# EAGLE design hs-64-spi (EAGLE 9.5.1)
DESIGNER: JON NEWMAN, JAKOB VOIGTS; DESIGN_NAME: HEADSTAGE-64; LICENSE: CERN OHL v1.2; REVISION: 1.2
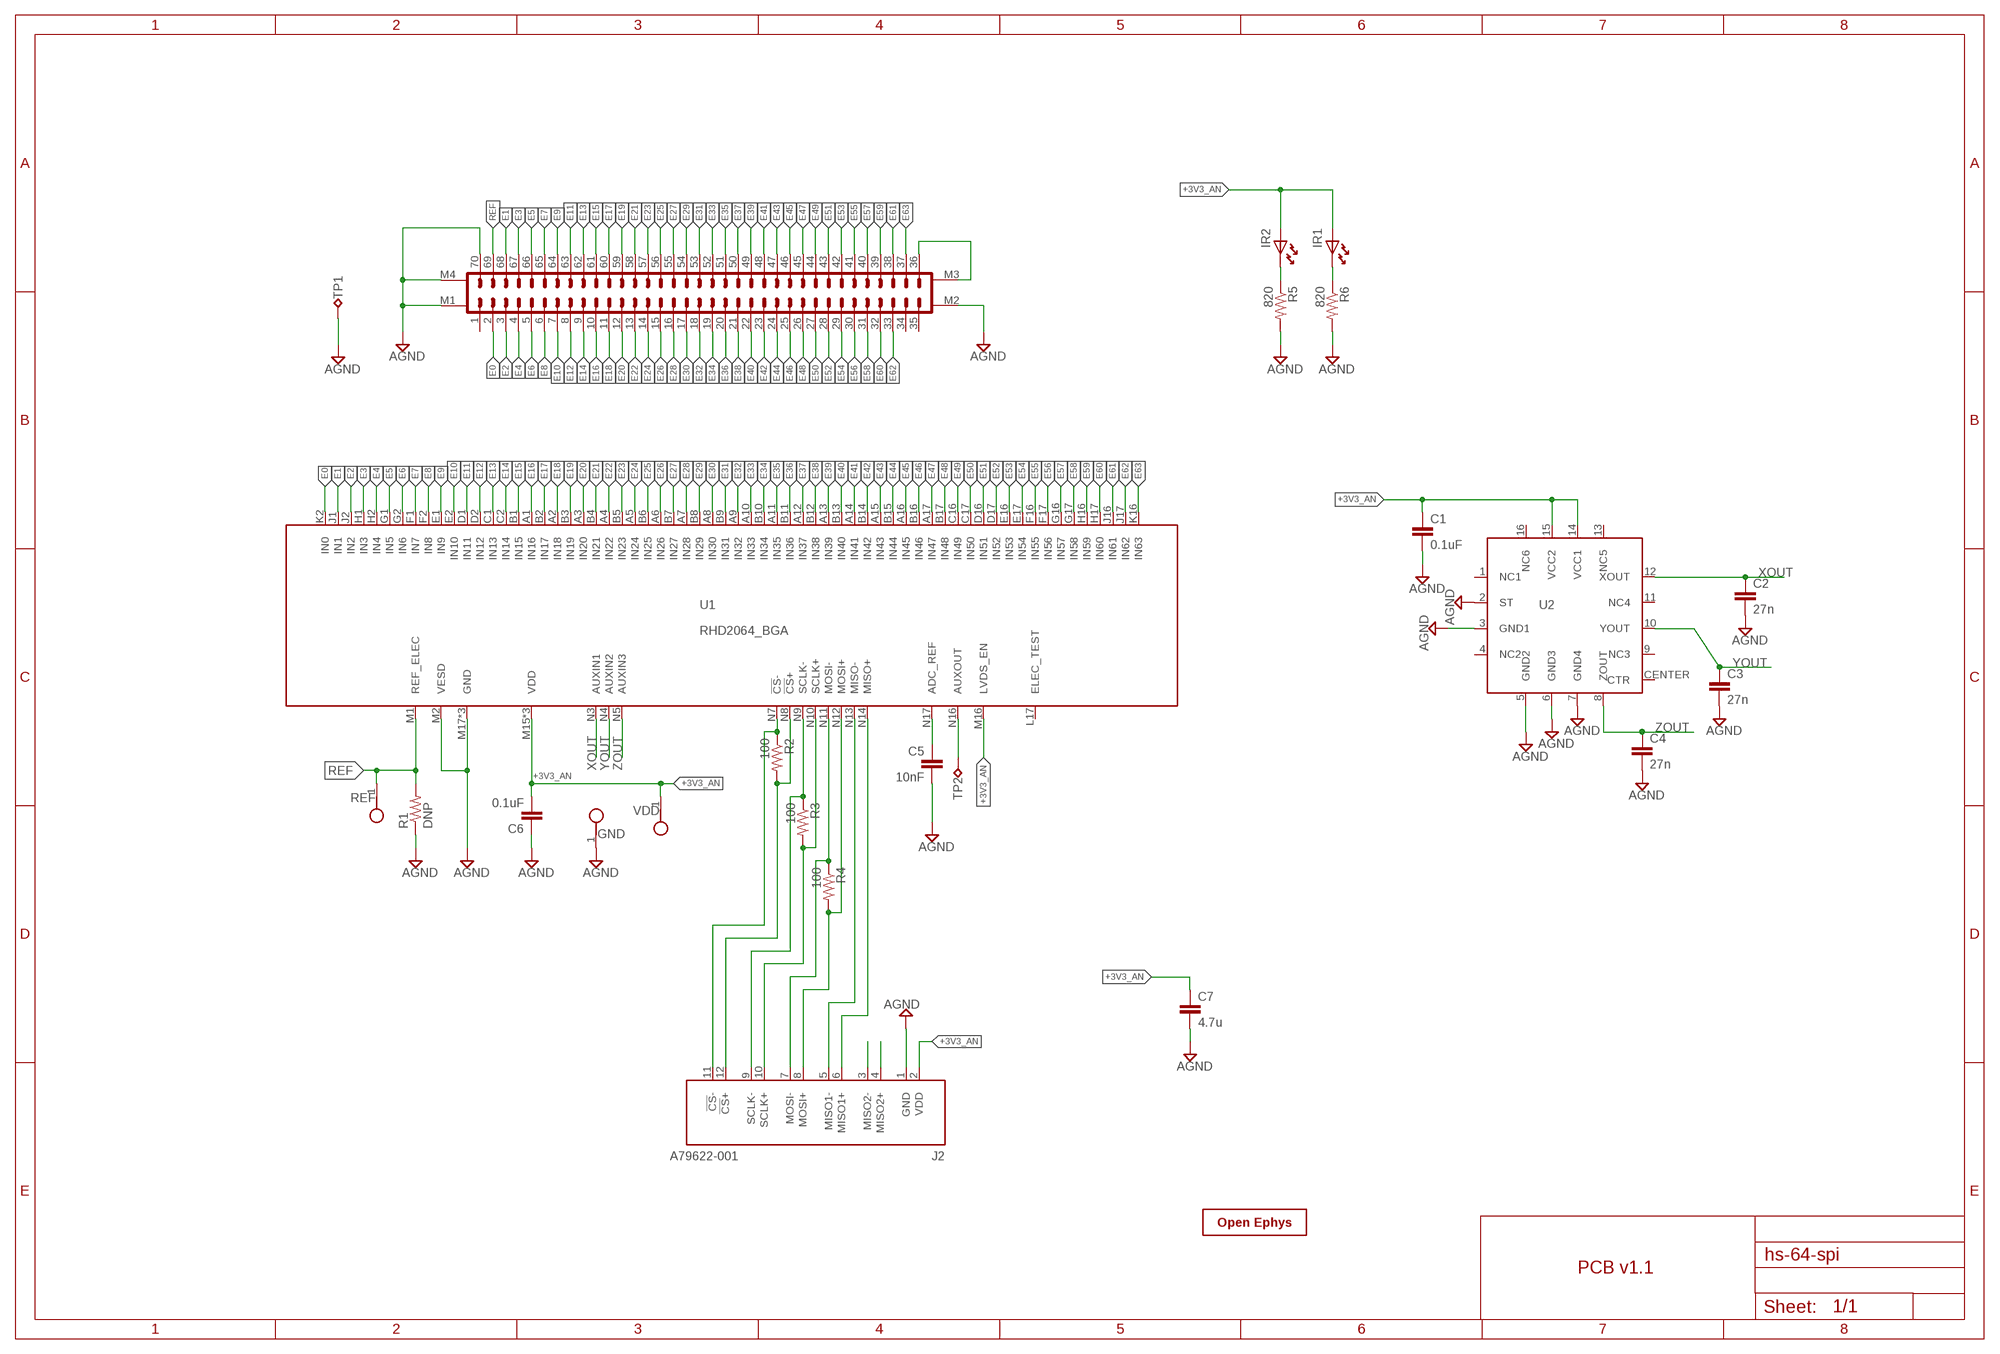
[diagram p0: schematic, sheet 1]

## Parts
C1  0.1uF  C_0402  [0402]
C2  27n  C_0402  [0402]
C3  27n  C_0402  [0402]
C4  27n  C_0402  [0402]
C5  10nF  C_0402T  [0402T]
C6  0.1uF  C_0402T  [0402T]
C7  4.7u  C_0402  [0402]
GND  TESTPOINT_SMALL  [TESTPOINT_SMALL]
IR1  LEDHAND  [LED_HAND]
IR2  LEDHAND  [LED_HAND]
J1  DF40C-70DP-0.4V(51)  PINHD-2X35+4DF40-70HEAD-LESS-SILK  [DF40-70HEAD-LESS-SILK]
J2  A79622-001  [A79622-001]
R1  DNP  R_0603  [0603]
R2  100  R_0402  [0402]
R3  100  R_0402  [0402]
R4  100  R_0402  [0402]
R5  820  R_0402  [0402]
R6  820  R_0402  [0402]
REF  TESTPOINT_SMALL  [TESTPOINT_SMALL]
TP1  VCC  TPTP07R  [TP07R]
TP2  VCC  TPTP07R  [TP07R]
U1  RHD2064_BGA  RHD2164_BGA_BGA  [BGA104_0.5MM]
U2  ADXL335_IDAX  [ADXL335_IDAX]
VDD  TESTPOINT_SMALL  [TESTPOINT_SMALL]
X  OE-LOGO_3.5X2.5  [OE-LOGO-3.5X2.5]

## Nets
+3V3_AN: C1.1 C6.2 C7.1 IR1.A IR2.A J2.2(VDD) U1.M15(VDD) U1.M16(LVDS_EN) U1.N2(VDD) U1.N15(VDD) U2.14(VCC1) U2.15(VCC2) VDD.1
AGND: C1.2 C2.2 C3.2 C4.2 C5.2 C6.1 C7.2 GND.1 J1.70 J1.M1 J1.M2 J1.M4 J2.1(GND) R1.1 R5.2 R6.2 TP1.TP U1.M2(VESD) U1.M17(GND) U1.N1(GND) U1.N6(GND) U2.2(ST) U2.3(GND1) U2.5(GND2) U2.6(GND3) U2.7(GND4)
E0: J1.2 U1.K2(IN0)
E1: J1.68 U1.J1(IN1)
E2: J1.3 U1.J2(IN2)
E3: J1.67 U1.H1(IN3)
E4: J1.4 U1.H2(IN4)
E5: J1.66 U1.G1(IN5)
E6: J1.5 U1.G2(IN6)
E7: J1.65 U1.F1(IN7)
E8: J1.6 U1.F2(IN8)
E9: J1.64 U1.E1(IN9)
E10: J1.7 U1.E2(IN10)
E11: J1.63 U1.D1(IN11)
E12: J1.8 U1.D2(IN12)
E13: J1.62 U1.C1(IN13)
E14: J1.9 U1.C2(IN14)
E15: J1.61 U1.B1(IN15)
E16: J1.10 U1.A1(IN16)
E17: J1.60 U1.B2(IN17)
E18: J1.11 U1.A2(IN18)
E19: J1.59 U1.B3(IN19)
E20: J1.12 U1.A3(IN20)
E21: J1.58 U1.B4(IN21)
E22: J1.13 U1.A4(IN22)
E23: J1.57 U1.B5(IN23)
E24: J1.14 U1.A5(IN24)
E25: J1.56 U1.B6(IN25)
E26: J1.15 U1.A6(IN26)
E27: J1.55 U1.B7(IN27)
E28: J1.16 U1.A7(IN28)
E29: J1.54 U1.B8(IN29)
E30: J1.17 U1.A8(IN30)
E31: J1.53 U1.B9(IN31)
E32: J1.18 U1.A9(IN32)
E33: J1.52 U1.A10(IN33)
E34: J1.19 U1.B10(IN34)
E35: J1.51 U1.A11(IN35)
E36: J1.20 U1.B11(IN36)
E37: J1.50 U1.A12(IN37)
E38: J1.21 U1.B12(IN38)
E39: J1.49 U1.A13(IN39)
E40: J1.22 U1.B13(IN40)
E41: J1.48 U1.A14(IN41)
E42: J1.23 U1.B14(IN42)
E43: J1.47 U1.A15(IN43)
E44: J1.24 U1.B15(IN44)
E45: J1.46 U1.A16(IN45)
E46: J1.25 U1.B16(IN46)
E47: J1.45 U1.A17(IN47)
E48: J1.26 U1.B17(IN48)
E49: J1.44 U1.C16(IN49)
E50: J1.27 U1.C17(IN50)
E51: J1.43 U1.D16(IN51)
E52: J1.28 U1.D17(IN52)
E53: J1.42 U1.E16(IN53)
E54: J1.29 U1.E17(IN54)
E55: J1.41 U1.F16(IN55)
E56: J1.30 U1.F17(IN56)
E57: J1.40 U1.G16(IN57)
E58: J1.31 U1.G17(IN58)
E59: J1.39 U1.H16(IN59)
E60: J1.32 U1.H17(IN60)
E61: J1.38 U1.J16(IN61)
E62: J1.33 U1.J17(IN62)
E63: J1.37 U1.K16(IN63)
N$1: J2.3(MISO2-)
N$2: J2.4(MISO2+)
N$3: IR2.K R5.1
N$4: IR1.K R6.1
N$36: C5.1 U1.N17(ADC_REF)
N$39: TP2.TP U1.N16(AUXOUT)
REF: J1.69 R1.2 REF.1 U1.M1(REF_ELEC)
RHD_CLK_N [diff]: J2.9(SCLK-) R3.1 U1.N9(SCLK-)
RHD_CLK_P [diff]: J2.10(SCLK+) R3.2 U1.N10(SCLK+)
RHD_CS_N [diff]: J2.11(!CS!-) R2.1 U1.N7(!CS!-)
RHD_CS_P [diff]: J2.12(!CS!+) R2.2 U1.N8(!CS!+)
RHD_MISO_N [diff]: J2.5(MISO1-) U1.N13(MISO-)
RHD_MISO_P [diff]: J2.6(MISO1+) U1.N14(MISO+)
RHD_MOSI_N [diff]: J2.7(MOSI-) R4.1 U1.N11(MOSI-)
RHD_MOSI_P [diff]: J2.8(MOSI+) R4.2 U1.N12(MOSI+)
VCOAX: J1.36 J1.M3
XOUT: C2.1 U1.N3(AUXIN1) U2.12(XOUT)
YOUT: C3.1 U1.N4(AUXIN2) U2.10(YOUT)
ZOUT: C4.1 U1.N5(AUXIN3) U2.8(ZOUT)
Unconnected: J1.1 J1.34 J1.35 U1.L17(ELEC_TEST) U2.1(NC1) U2.4(NC2) U2.9(NC3) U2.11(NC4) U2.13(NC5) U2.16(NC6) U2.CENTER(CTR)

## Notes on the sheet
- PCB v1.1

## Library data of the parts
C1-C4 C6 C7 = jonnew:C: Capacitor
C5 = jonnew:C: Capacitor; PARTNO: GRM033R71E103KE14D
GND REF VDD = RHD2000_eval_board:TESTPOINT: PCB Test Point
IR1 IR2 = CNP-miscellaneous:LED
J1 = jonnew:PINHD-2X35+4
J2 = hs-64-spi:A79622-001
R1 = jonnew:R: Resistor; DK: PxxxxHTR-ND; MN: Panasonic; MPN: ERJ-3EKFxxxxV
R2-R6 = jonnew:R: Resistor
TP1 TP2 = jonnew:TP: Test pad
U1 = jonnew:RHD2164_BGA: Intan Technologies RHD2164 chip
U2 = hs-64-spi:ADXL335
X = jonnew:OE-LOGO

## Net classes
1 thick: width 0.102 mm
2 diff: width 0.076 mm, drill 0.1 mm, clearance 0.051 mm

## Board
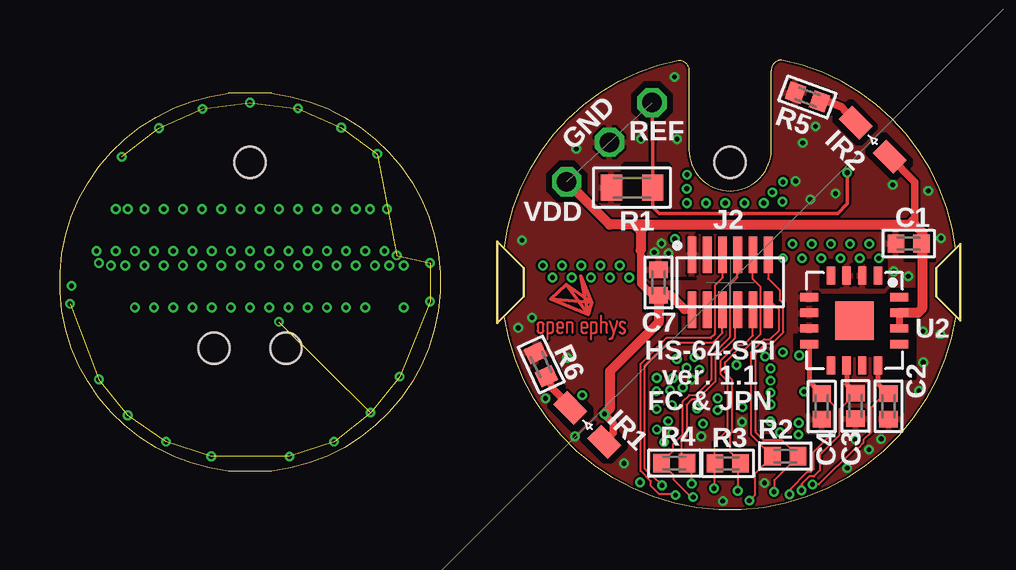
[diagram p1: board, top side]
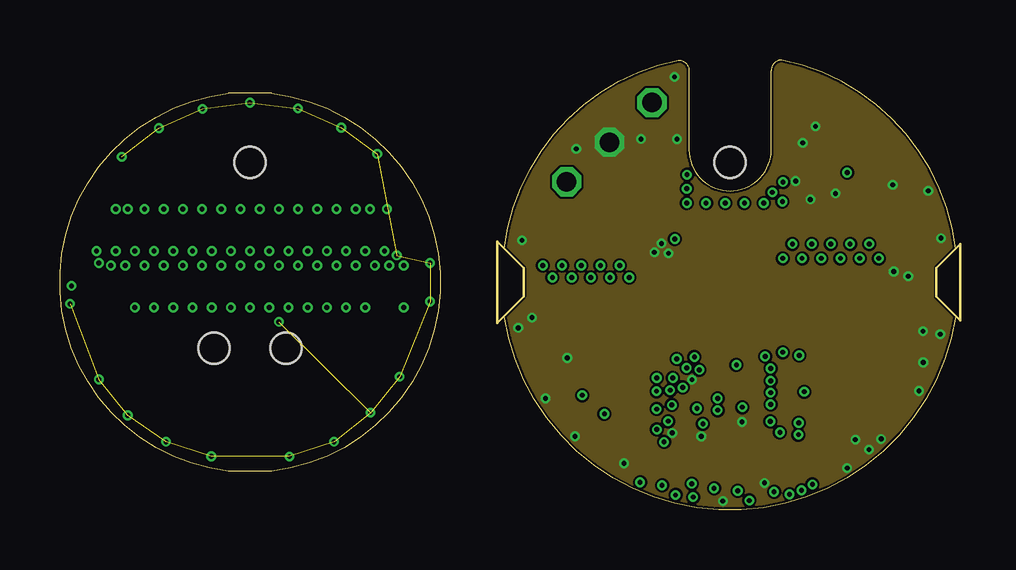
[diagram p2: board, inner layer PWR]
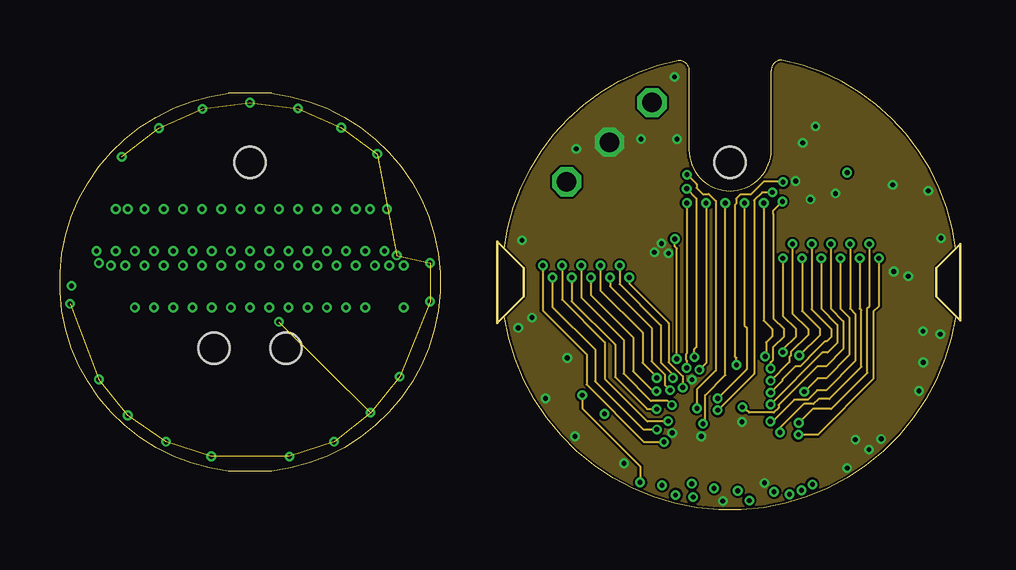
[diagram p3: board, inner layer GND]
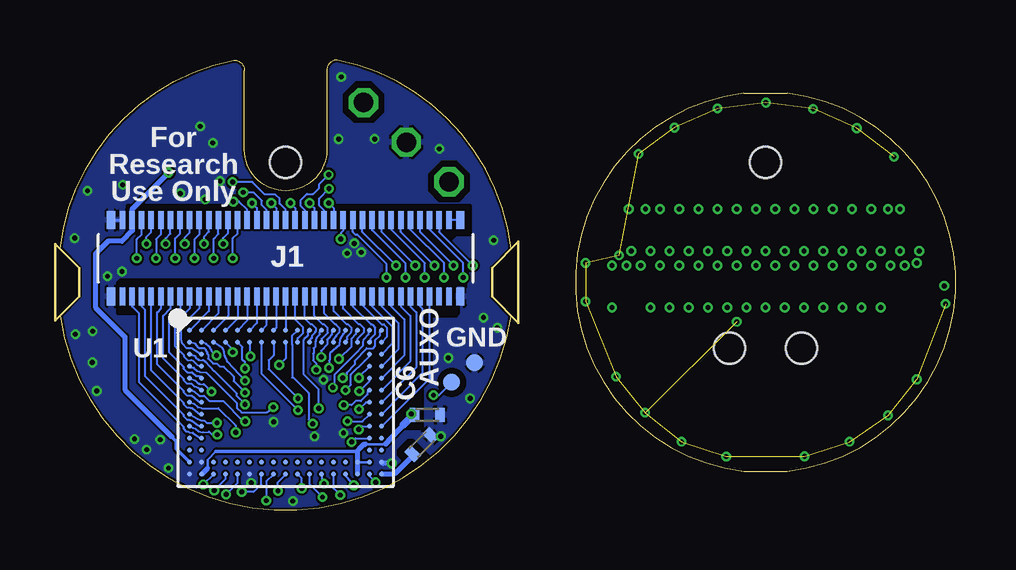
[diagram p4: board, bottom side, seen from below]

Size 37.32 x 18.76 mm. Coordinates in mm from the lower left corner, seen from the top.
Outline: 18.52,10.89 19.32,10.09 19.32,8.89 18.52,8.09 arc163 37.32,8.09 36.52,8.89 36.52,10.09 37.32,10.89 arc72 30.08,18.76 arc90 29.63,18.32 29.63,15.02 arc-90 27.92,13.3 arc-90 26.21,15.02 26.21,18.32 arc90 25.76,18.76 arc72 18.52,10.89
Outline: 8.83,1.61 7.01,1.61 arc-167 7.01,17.37 8.83,17.37 arc-167 8.83,1.61
Copper layers (1*2+3*16): Top 0.035mm / dielectric 0.2mm / PWR 0.0175mm / dielectric 0.3mm / GND 0.035mm / dielectric 0.2mm / Bottom 0.035mm
Design rules "seeed-studio-4-layer *": minimum track width 0.09mm, minimum drill 0.2mm, track to track 0.09mm, track to pad 0.09mm, pad to pad 0.09mm, via to via 0.09mm, smd to smd 0mil, copper to edge 0.1mm, drill to drill 10mil, minimum pad ring 6mil, minimum via ring 4mil, stop-mask expansion 1mil, vias tented up to drill 100mil, thermal gap 0.1mm
Holes 1.3 mm at 27.92,14.49 6.42,6.74 9.42,6.74 7.92,14.49
tKeepout: area 18.4,6.6 to 19.9,12.4; area 18.4,6.6 to 19.9,12.4; area 35.9,6.6 to 37.4,12.4; area 35.9,6.6 to 37.4,12.4
tRestrict: 137 lines
bRestrict: area 20.5,4.8 to 21.5,5.9; 41 lines
Milling: 8 lines

### Footprints (pad centres in the part's own frame; a part is rotated, then mirrored left to right if it is on the bottom)
0402 = smd 0.686 x 0.762: 1 -0.533,0; 2 0.533,0
0402T = smd 0.4 x 0.6: 1 -0.533,0; 2 0.533,0
TESTPOINT_SMALL = drill 0.813 octagon: 1 0,0
LED_HAND = smd 1.2 x 0.8: A -1,0; K 1,0
DF40-70HEAD-LESS-SILK = smd 0.23 x 0.75: 1 -6.8,-1.585; 2 -6.4,-1.585; 3 -6,-1.585; 4 -5.6,-1.585; 5 -5.2,-1.585; 6 -4.8,-1.585; 7 -4.4,-1.585; 8 -4,-1.585; 9 -3.6,-1.585; 10 -3.2,-1.585; 11 -2.8,-1.585; 12 -2.4,-1.585; 13 -2,-1.585; 14 -1.6,-1.585; 15 -1.2,-1.585; 16 -0.8,-1.585; 17 -0.4,-1.585; 18 0,-1.585; 19 0.4,-1.585; 20 0.8,-1.585; 21 1.2,-1.585; 22 1.6,-1.585; 23 2,-1.585; 24 2.4,-1.585; 25 2.8,-1.585; 26 3.2,-1.585; 27 3.6,-1.585; 28 4,-1.585; 29 4.4,-1.585; 30 4.8,-1.585; 31 5.2,-1.585; 32 5.6,-1.585; 33 6,-1.585; 34 6.4,-1.585; 35 6.8,-1.585; 36 6.8,1.585; 37 6.4,1.585; 38 6,1.585; 39 5.6,1.585; 40 5.2,1.585; 41 4.8,1.585; 42 4.4,1.585; 43 4,1.585; 44 3.6,1.585; 45 3.2,1.585; 46 2.8,1.585; 47 2.4,1.585; 48 2,1.585; 49 1.6,1.585; 50 1.2,1.585; 51 0.8,1.585; 52 0.4,1.585; 53 0,1.585; 54 -0.4,1.585; 55 -0.8,1.585; 56 -1.2,1.585; 57 -1.6,1.585; 58 -2,1.585; 59 -2.4,1.585; 60 -2.8,1.585; 61 -3.2,1.585; 62 -3.6,1.585; 63 -4,1.585; 64 -4.4,1.585; 65 -4.8,1.585; 66 -5.2,1.585; 67 -5.6,1.585; 68 -6,1.585; 69 -6.4,1.585; 70 -6.8,1.585 | smd 0.35 x 0.75: M1 -7.275,-1.585; M2 7.275,-1.585; M3 7.275,1.585; M4 -7.275,1.585
A79622-001 = smd 0.36 x 1.524: 1 -1.587,1.143; 2 -1.587,-1.143; 3 -0.953,1.143; 4 -0.953,-1.143; 5 -0.318,1.143; 6 -0.318,-1.143; 7 0.318,1.143; 8 0.318,-1.143; 9 0.953,1.143; 10 0.953,-1.143; 11 1.587,1.143; 12 1.587,-1.143
0603 = smd 0.889 x 1.067: 1 -0.864,0; 2 0.864,0
TP07R = smd 0.7 x 0.7: TP 0,0
BGA104_0.5MM = smd 0.2 x 0.2: A1 -4,3; A2 -3.5,3; A3 -3,3; A4 -2.5,3; A5 -2,3; A6 -1.5,3; A7 -1,3; A8 -0.5,3; A9 0,3; A10 0.5,3; A11 1,3; A12 1.5,3; A13 2,3; A14 2.5,3; A15 3,3; A16 3.5,3; A17 4,3; B1 -4,2.5; B2 -3.5,2.5; B3 -3,2.5; B4 -2.5,2.5; B5 -2,2.5; B6 -1.5,2.5; B7 -1,2.5; B8 -0.5,2.5; B9 0,2.5; B10 0.5,2.5; B11 1,2.5; B12 1.5,2.5; B13 2,2.5; B14 2.5,2.5; B15 3,2.5; B16 3.5,2.5; B17 4,2.5; C1 -4,2; C2 -3.5,2; C16 3.5,2; C17 4,2; D1 -4,1.5; D2 -3.5,1.5; D16 3.5,1.5; D17 4,1.5; E1 -4,1; E2 -3.5,1; E16 3.5,1; E17 4,1; F1 -4,0.5; F2 -3.5,0.5; F16 3.5,0.5; F17 4,0.5; G1 -4,0; G2 -3.5,0; G16 3.5,0; G17 4,0; H1 -4,-0.5; H2 -3.5,-0.5; H16 3.5,-0.5; H17 4,-0.5; J1 -4,-1; J2 -3.5,-1; J16 3.5,-1; J17 4,-1; K1 -4,-1.5; K2 -3.5,-1.5; K16 3.5,-1.5; K17 4,-1.5; L1 -4,-2; L2 -3.5,-2; L16 3.5,-2; L17 4,-2; M1 -4,-2.5; M2 -3.5,-2.5; M3 -3,-2.5; M4 -2.5,-2.5; M5 -2,-2.5; M6 -1.5,-2.5; M7 -1,-2.5; M8 -0.5,-2.5; M9 0,-2.5; M10 0.5,-2.5; M11 1,-2.5; M12 1.5,-2.5; M13 2,-2.5; M14 2.5,-2.5; M15 3,-2.5; M16 3.5,-2.5; M17 4,-2.5; N1 -4,-3; N2 -3.5,-3; N3 -3,-3; N4 -2.5,-3; N5 -2,-3; N6 -1.5,-3; N7 -1,-3; N8 -0.5,-3; N9 0,-3; N10 0.5,-3; N11 1,-3; N12 1.5,-3; N13 2,-3; N14 2.5,-3; N15 3,-3; N16 3.5,-3; N17 4,-3
ADXL335_IDAX = smd 0.75 x 0.35: 1 -1.875,0.975; 2 -1.875,0.325; 3 -1.875,-0.325; 4 -1.875,-0.975; 9 1.875,-0.975; 10 1.875,-0.325; 11 1.875,0.325; 12 1.875,0.975 | smd 0.35 x 0.75: 5 -0.975,-1.875; 6 -0.325,-1.875; 7 0.325,-1.875; 8 0.975,-1.875; 13 0.975,1.875; 14 0.325,1.875; 15 -0.325,1.875; 16 -0.975,1.875 | smd 1.6 x 1.6: CENTER 0,0

### Placement (x,y rotation side)
C1  35.36,11.11 180 top
C2  34.52,4.32 270 top
C3  33.15,4.33 270 top
C4  31.74,4.31 270 top
C5  22.25,2.72 45 bottom
C6  22.02,3.96 180 bottom
C7  24.94,9.48 90 top
GND  22.89,15.33 0 top
IR1  21.98,3.55 135 top
IR2  33.86,15.44 135 top
J1  27.92,10.49 0 bottom
J2  27.92,9.49 0 top
R1  23.84,13.44 0 top
R2  30.22,2.24 180 top
R3  27.82,1.94 180 top
R4  25.6,1.95 0 top
R5  31.15,17.22 160 top
R6  20.05,6.06 115 top
REF  24.67,16.99 0 top
TP1  20.04,6.14 0 bottom
TP2  21,5.32 0 bottom
U1  27.92,4.49 0 bottom
U2  33.1,7.89 270 top
VDD  21.11,13.68 0 top
X  21.55,8.05 0 top

### Tracks (layer width: path | path; a pad name or v marks a point on that pad's centre or on a via)
+3V3_AN  (via drill 0.2)
  Top 0.3: C7.1 24.69,8.95 | U2.15 U2.14 | 35.92,10.63 C1.1
  Top 0.305: 24.69,8.95 24.19,9.45 24.19,10.82 | 35.62,11.89 35.62,12.19 | 35.62,12.19 35.62,13.68 IR2.A | v22.68,4 22.76,3.91 23.04,3.63 23.04,3.2 IR1.A | 35.31,11.88 35.62,12.19
  Top 0.381: J2.2 26.03,8.35 25.43,8.95 C7.1
  Top 0.406: C7.1 24.94,7.81 22.92,5.79 22.92,4.24 v22.68,4 | C1.1 35.92,10.87 | U2.15 35.74,8.22 35.92,8.39 35.92,10.63 35.92,10.87 | 24.43,11.89 35.62,11.89 35.92,11.59 35.92,10.87 | 24.43,11.89 24.19,11.65 | 24.19,11.65 24.19,10.82 | 24.43,11.89 22.9,11.89 VDD.1 | 23.95,11.87 24.19,11.63 24.19,11.65
  Bottom 0.09: 23.82,2.73 23.77,2.73 23.76,2.74
  Bottom 0.1: 30.83,2.43 31.17,2.09 31.17,1.74 | 24.59,2.73 23.82,2.73 | 24.88,2.52 24.92,2.47 24.92,2.43 | U1.M16 U1.M15
  Bottom 0.15: 24.92,2.43 30.83,2.43
  Bottom 0.152: U1.M15 24.92,2.43 | C6.2 23.04,3.5 23.11,3.43
  Bottom 0.2: U1.N2 31.17,1.74 | 23.63,2.91 23.04,3.5 23.02,3.52 23.02,3.55 | 23.63,2.91 23.63,2.87 23.76,2.74 | 24.88,2.52 24.66,2.73 24.59,2.73 | 24.92,2.47 U1.M15 U1.N15 | 23.11,3.43 23.63,2.91
  Bottom 0.3: 22.82,3.75 22.53,4.03 v22.68,4
  Bottom 0.305: 22.82,3.75 23.02,3.55
AGND  (via drill 0.2 pad 0.25)
  Bottom 0.127: J1.M4 J1.70
  Bottom 0.2: v23.5,1.94 23.87,1.94 U1.M17
  other vias: 36.18,13.3 32.31,13.19 31.27,12.94 30.65,13.71 32.8,1.75 25.71,15.46 31.48,15.99 33.71,2.51 34.21,2.96 25.06,11.11 24.77,10.74 25.36,10.7 34.74,9.94 20.23,4.65 19.1,7.59 21.14,6.34 19.67,8.02 35.79,4.96 36.68,7.32 35.97,6.15 35.96,7.45 34.7,13.56 30.95,15.3 25.6,18.05 19.25,11.24 36.71,11.33 33.14,2.93 29.35,1.12 24.21,15.47 35.34,9.74 26.72,3.07 28.42,3.67 25.51,3.21 27.62,0.37 21.46,3.06 26.34,5.43 21.51,15.06
  pour Top (isolate 0.05, rank 3): 16.52,19.29 38.12,19.29 38.12,-0.61 16.52,-0.61
  pour GND (isolate 0.05, rank 3, no thermals): 16.72,19.09 38.32,19.09 38.32,-0.81 16.72,-0.81
  pour Bottom (isolate 0.05, rank 3): 16.83,18.99 38.43,18.99 38.43,-0.91 16.83,-0.91
  pour PWR (isolate 0.05, rank 3, no thermals): 16.62,19.19 38.22,19.19 38.22,-0.71 16.62,-0.71
CAT1  (via drill 0.2)
  other vias: 0.48,9.34
E0
  Bottom 0.09: 34.32,8.49 34.02,8.19 34.02,5.32 32.16,3.45 32.16,3.4 32.05,3.26 31.99,3.26 31.95,3.24 31.78,3.21 31.51,3.02 U1.K2
  Bottom 0.1: J1.2 34.32,8.49
E1  (via drill 0.2)
  GND 0.09: v34.12,10.49 34.12,8.49 33.9,8.27 33.9,5.47 31.56,3.14 v30.77,3.14
  Bottom 0.09: J1.68 33.92,11.49 34.12,11.29 v34.12,10.49 | U1.J1 31.77,3.41 31.68,3.39 31.53,3.27 31.37,3.23 31.11,3.26 30.98,3.14 v30.77,3.14
E2
  Bottom 0.09: J1.3 33.92,8.49 33.77,8.34 33.77,5.57 32.16,3.95 32.16,3.89 32.02,3.75 31.94,3.75 31.89,3.74 31.81,3.71 31.56,3.53 U1.J2
E3  (via drill 0.2)
  GND 0.09: v33.72,11.09 33.72,8.49 33.65,8.42 33.65,5.72 32.14,4.21 31.36,4.21 v30.78,3.63
  Bottom 0.09: J1.67 33.52,11.58 33.72,11.38 v33.72,11.09 | U1.H1 31.59,3.79 31.46,3.74 31.45,3.73 31.31,3.73 31.21,3.63 v30.78,3.63
E4
  Bottom 0.09: J1.4 33.52,5.82 32.16,4.45 32.16,4.39 32.02,4.26 31.9,4.26 31.88,4.24 31.82,4.24 31.56,4.02 U1.H2
E5  (via drill 0.2)
  GND 0.09: v33.32,10.49 33.32,8.39 33.4,8.32 33.4,5.97 32.06,4.63 31.61,4.63 31.39,4.41 30.98,4.41 30,3.43 v30,3.23
  Bottom 0.09: v33.32,10.49 33.32,11.29 33.12,11.49 J1.66 | U1.G1 31.75,4.43 31.56,4.27 31.42,4.24 30.72,4.24 30,3.52 v30,3.23
E6
  Bottom 0.09: J1.5 33.12,8.39 33.27,8.24 33.27,6.07 32.16,4.95 32.16,4.89 32.02,4.76 31.83,4.76 31.56,4.52 U1.G2
E7  (via drill 0.2)
  GND 0.09: v32.92,11.09 32.92,8.39 33.15,8.17 33.15,6.22 U1.F1 31.55,4.99 31.15,4.59 30.59,4.59 29.69,3.69 v29.6,3.69
  Bottom 0.09: J1.65 32.72,11.52 32.92,11.32 v32.92,11.09 | U1.F1 31.82,4.99 31.79,4.96 31.73,4.93 31.52,4.76 31.32,4.76 31.09,4.54 30.52,4.54 29.67,3.69 v29.6,3.69
E8
  Bottom 0.09: J1.6 32.72,8.39 33.02,8.09 33.02,6.32 32.16,5.45 32.16,5.39 32.02,5.26 31.83,5.26 31.72,5.14 31.58,5.09 U1.F2
E9  (via drill 0.2)
  GND 0.09: v32.52,10.49 32.52,8.39 32.9,8.02 32.9,6.47 U1.E1 31.57,5.49 v31.01,4.93
  Bottom 0.09: J1.64 32.32,11.52 32.52,11.32 v32.52,10.49 | U1.E1 31.69,5.39 31.61,5.32 31.51,5.26 31.35,5.24 31.33,5.23 31.32,5.23 31.02,4.93 v31.01,4.93
E10
  Bottom 0.09: J1.7 32.32,8.39 32.77,7.94 32.77,6.57 32.16,5.95 32.16,5.89 32.01,5.74 31.82,5.74 31.65,5.58 31.51,5.58 U1.E2
E11  (via drill 0.2)
  GND 0.09: v32.12,11.09 32.12,8.39 32.65,7.87 32.65,6.72 U1.D1 31.56,5.99 29.95,4.38 29.95,4.26 29.75,4.06 28.71,4.06 v28.43,4.28
  Bottom 0.09: J1.63 31.92,11.56 32.12,11.36 v32.12,11.09 | U1.D1 31.85,5.92 31.74,5.92 31.61,5.8 31.5,5.76 31.23,5.72 29.95,4.46 29.95,4.26 29.75,4.06 28.71,4.06 v28.43,4.28
E12
  Bottom 0.09: J1.8 31.92,8.39 32.52,7.79 32.52,6.82 32.16,6.45 32.16,6.39 32,6.24 31.86,6.25 31.78,6.22 31.6,6.04 U1.D2
E13  (via drill 0.2)
  GND 0.09: v31.72,10.49 31.72,8.39 32.4,7.72 32.4,6.97 31.99,6.56 31.77,6.56 v29.61,4.4
  Bottom 0.09: v31.72,10.49 31.72,11.28 31.52,11.48 J1.62 | U1.C1 31.9,6.45 31.82,6.46 31.72,6.42 31.65,6.36 31.53,6.26 31.38,6.24 31.36,6.24 31.26,6.17 30.89,5.78 30.88,5.78 29.95,4.85 29.95,4.75 29.61,4.41 v29.61,4.4
E14
  Bottom 0.09: J1.9 31.52,8.39 32.27,7.64 32.27,7.09 32.23,6.94 32.04,6.74 31.84,6.73 31.48,6.51 U1.C2
E15  (via drill 0.2)
  GND 0.09: v31.32,11.09 31.32,8.37 32.15,7.54 32.15,7.22 31.97,7.04 31.88,7.04 31.19,6.34 31.19,6.32 30.85,5.98 30.64,5.98 30.1,5.44 30.1,5.38 v29.61,4.89
  Bottom 0.09: J1.61 31.12,11.6 31.32,11.4 v31.32,11.09 | U1.B1 31.73,6.95 31.6,6.82 31.52,6.76 31.32,6.75 31.24,6.69 31.19,6.59 31.19,6.51 31.15,6.47 31.15,6.31 30.94,6.11 30.79,6.11 30.65,5.96 30.49,5.96 30.09,5.56 30.09,5.37 v29.61,4.89
E16
  Bottom 0.09: U1.A1 31.12,8.29 J1.10
E17  (via drill 0.2)
  GND 0.09: v30.92,10.49 30.92,8.29 31.67,7.54 31.67,7.29 v30.8,6.44
  Bottom 0.09: J1.60 30.72,11.5 30.92,11.3 v30.92,10.49 | v30.8,6.44 31,6.6 30.99,6.62 31.01,6.64 31.01,6.66 31.04,6.71 31.07,6.75 31.07,6.78 31.1,6.81 31.13,6.84 31.16,6.85 31.18,6.87 31.22,6.91 31.24,6.92 31.26,6.93 31.38,6.95 U1.B2
E18
  Bottom 0.09: U1.A2 30.72,8.19 J1.11
E19  (via drill 0.2)
  GND 0.09: v30.52,11.09 30.52,8.19 31.17,7.54 31.17,7.29 30.46,6.58 30.46,6.43 30.39,6.37 30.39,6.17 v29.61,5.38
  Bottom 0.09: J1.59 30.32,11.54 30.52,11.34 v30.52,11.09 | v29.61,5.38 30.36,6.18 30.4,6.32 30.45,6.42 30.49,6.6 30.52,6.71 30.56,6.77 30.86,6.99 U1.B3
E20
  Bottom 0.09: U1.A3 30.32,8.09 J1.12
E21  (via drill 0.2)
  GND 0.09: v30.12,10.49 30.12,8.09 30.67,7.54 30.67,7.24 30.12,6.69 v30.12,6.57
  Bottom 0.09: J1.58 29.92,11.53 30.12,11.33 v30.12,10.49 | v30.12,6.57 30.18,6.75 U1.B4
E22
  Bottom 0.09: U1.A4 29.92,7.99 J1.13
E23  (via drill 0.2)
  GND 0.09: v29.61,5.9 29.61,6.15 29.72,6.26 29.72,6.79 30.17,7.24 30.17,7.54 29.72,7.99 29.72,12.29 29.72,12.33 29.72,12.48 v30.1,12.86
  Bottom 0.09: J1.57 29.52,12.52 29.86,12.86 v30.1,12.86 | v29.61,5.9 29.61,6.15 29.72,6.26 29.72,6.79 U1.B5
E24
  Bottom 0.09: U1.A5 29.52,7.89 J1.14
E25  (via drill 0.2)
  GND 0.09: v29.32,12.79 29.32,7.89 29.67,7.54 29.67,7.24 U1.B6 29.42,6.44 v29.38,6.4
  Bottom 0.09: U1.B6 29.42,6.44 v29.38,6.4 | v29.32,12.79 29.12,12.59 J1.56
E26
  Bottom 0.09: U1.A6 29.12,7.79 J1.15
E27  (via drill 0.2)
  GND 0.09: v27.4,4.16 28.92,5.68 28.92,12.91 29.25,13.24 v29.68,13.24
  Bottom 0.09: v27.4,4.16 28.92,5.68 U1.B7 | J1.55 28.72,12.52 28.91,12.71 28.91,12.9 29.26,13.24 v29.68,13.24
E28
  Bottom 0.09: U1.A7 28.72,7.69 J1.16
E29  (via drill 0.2)
  GND 0.09: v28.52,12.79 28.52,7.69 28.61,7.6 28.61,5.86 v27.4,4.65
  Bottom 0.09: U1.B8 28.42,6.44 28.62,6.24 28.62,5.87 v27.4,4.65 | v28.52,12.79 28.32,12.59 J1.54
E30
  Bottom 0.09: U1.A8 28.32,7.59 J1.17
E31  (via drill 0.2)
  GND 0.09: v28.19,6.05 28.19,6.35 28.12,6.41 28.12,12.72 28.17,12.77 28.17,12.97 28.35,13.15 28.78,13.15 29.32,13.68 30.12,13.68 v30.13,13.67
  Bottom 0.09: U1.B9 27.92,6.31 v28.19,6.05 | J1.53 27.92,12.52 28.17,12.77 28.17,12.97 28.35,13.15 28.78,13.15 29.31,13.67 v30.13,13.67
E32
  Bottom 0.09: J1.18 U1.A9
E33  (via drill 0.2)
  GND 0.09: v27.72,12.79 27.72,5.62 26.88,4.78 26.88,3.68 v26.79,3.59
  Bottom 0.09: U1.A10 27.66,7.26 27.66,6.9 27.65,6.89 27.65,5.52 27.61,5.52 26.96,4.87 26.96,3.76 v26.79,3.59 | v27.72,12.79 27.52,12.59 J1.52
E34
  Bottom 0.09: J1.19 27.52,7.95 27.42,7.84 27.19,7.61 27.19,7.39 27.42,7.15 U1.B10
E35  (via drill 0.2)
  GND 0.09: v26.54,4.23 26.54,5.02 27.33,5.81 27.33,12.88 27.03,13.18 26.78,13.18 26.52,13.43 26.52,13.58 | v26.13,13.98 26.52,13.58 | 26.52,13.58
  Bottom 0.09: U1.A11 27.01,7.41 27.01,7.26 27.16,7.11 27.16,5.64 26.54,5.03 v26.54,4.23 | J1.51 27.12,12.5 27.29,12.67 27.29,12.92 27.03,13.18 26.78,13.18 26.52,13.43 26.52,13.58 v26.13,13.98
E36
  Bottom 0.09: J1.20 27.12,7.99 26.87,7.74 26.82,7.74 26.67,7.6 26.67,7.44 26.69,7.43 26.69,7.39 26.83,7.25 26.83,7.17 26.92,7.07 U1.B11
E37  (via drill 0.2)
  GND 0.09: v26.92,12.79 26.92,6.12 v26.64,5.84
  Bottom 0.09: U1.A12 26.49,7.42 26.49,7.33 26.63,7.18 26.66,7.08 26.66,7.04 26.67,6.99 26.67,6.82 26.75,6.74 26.75,6.53 26.77,6.51 26.77,6.23 26.64,6.1 v26.64,5.84 | v26.92,12.79 26.72,12.59 J1.50
E38
  Bottom 0.09: J1.21 26.72,8.09 26.37,7.74 26.32,7.74 26.17,7.6 26.17,7.39 26.42,7.14 U1.B12
E39  (via drill 0.2)
  GND 0.09: v26.11,13.39 26.52,12.99 26.52,6.79 26.44,6.7 v26.44,6.37
  Bottom 0.09: U1.A13 25.99,7.42 25.99,7.31 26.15,7.15 26.15,7.12 26.19,7.09 26.19,6.89 26.44,6.64 v26.44,6.37 | J1.49 26.32,12.49 26.52,12.69 26.52,12.98 v26.11,13.39
E40
  Bottom 0.09: J1.22 26.32,8.19 25.86,7.73 25.82,7.73 25.69,7.59 25.69,7.39 25.81,7.27 25.81,7.24 25.92,7.11 U1.B13
E41  (via drill 0.2)
  GND 0.09: v26.12,12.79 26.12,6.53 26.08,6.49 26.08,6.26 26.11,6.22 v26.11,5.92
  Bottom 0.09: U1.A14 25.42,7.43 25.46,7.39 25.49,7.35 25.65,7.11 25.67,6.87 26.08,6.52 26.08,6.26 26.11,6.22 v26.11,5.92 | v26.12,12.79 25.92,12.59 J1.48
E42
  Bottom 0.09: J1.23 25.92,8.29 25.37,7.74 25.32,7.74 25.17,7.6 25.17,7.45 25.19,7.42 25.19,7.39 25.34,7.23 25.35,7.22 25.35,7.12 U1.B14
E43  (via drill 0.2)
  GND 0.09: v25.62,11.29 25.62,10.99 25.7,10.91 v25.7,6.29
  Bottom 0.09: U1.A15 24.99,7.42 24.99,7.33 25.17,7.15 25.17,6.82 v25.7,6.29 | J1.47 25.52,11.65 25.62,11.55 v25.62,11.29
E44
  Bottom 0.09: J1.24 25.52,8.39 24.87,7.74 24.82,7.74 24.67,7.6 24.67,7.39 24.92,7.14 U1.B15
E45  (via drill 0.2)
  GND 0.09: v25.95,5.1 25.95,5.57 25.36,6.15 25.36,7.79 23.72,9.44 v23.72,9.69
  Bottom 0.09: U1.A16 24.47,7.44 24.47,7.31 24.67,7.11 24.69,6.98 24.69,6.85 24.72,6.82 24.99,6.53 25.87,5.64 25.87,5.18 v25.95,5.1 | J1.46 25.12,11.59 25.02,11.49 24.94,11.49 23.72,10.27 v23.72,9.69
E46
  Bottom 0.09: J1.25 25.12,8.49 24.36,7.73 24.32,7.73 24.19,7.59 24.19,7.34 24.37,7.16 24.37,7.05 U1.B16
E47  (via drill 0.2)
  GND 0.09: v25.54,5.5 25.54,5.65 25.04,6.14 25.04,7.69 23.32,9.41 v23.32,10.19
  Bottom 0.09: U1.A17 24.01,7.41 24.01,7.26 24.19,7.08 24.19,6.83 24.27,6.74 24.54,6.74 25.04,6.2 25.04,6.06 25.38,5.72 25.38,5.66 v25.54,5.5 | v23.32,10.19 24.72,11.59 J1.45
E48
  Bottom 0.09: J1.26 24.72,8.54 23.91,7.73 23.82,7.73 23.69,7.59 23.69,7.23 U1.B17
E49  (via drill 0.2)
  GND 0.09: v25.42,4.99 25.2,5.21 25.2,5.64 24.65,6.2 24.65,7.59 22.92,9.32 v22.92,9.69
  Bottom 0.09: v25.42,4.99 25.2,5.21 25.2,5.64 24.63,6.22 24.42,6.43 U1.C16 | v22.92,9.69 22.92,10.27 24.32,11.67 J1.44
E50
  Bottom 0.09: J1.27 24.32,8.49 23.47,7.64 23.47,6.94 U1.C17
E51  (via drill 0.2)
  GND 0.09: v24.86,5.5 24.86,5.55 24.28,6.14 24.28,7.39 22.52,9.15 v22.52,10.19
  Bottom 0.09: U1.D16 24.86,5.55 v24.86,5.5 | J1.43 23.92,11.59 v22.52,10.19
E52
  Bottom 0.09: J1.28 23.92,8.49 23.22,7.79 23.22,6.69 U1.D17
E53  (via drill 0.2)
  GND 0.09: v24.85,4.95 24.71,4.95 23.89,5.78 23.89,7.19 22.12,8.96 v22.12,9.69
  Bottom 0.09: v24.85,4.95 24.42,5.38 U1.E16 | J1.42 23.52,11.69 22.12,10.29 v22.12,9.69
E54
  Bottom 0.09: J1.29 23.52,8.49 22.97,7.94 22.97,6.44 U1.E17
E55  (via drill 0.2)
  GND 0.09: v25.5,4.37 25.33,4.54 24.62,4.54 23.48,5.68 23.48,7.09 21.72,8.85 v21.72,10.19
  Bottom 0.09: U1.F16 24.52,4.9 24.52,4.81 24.79,4.54 25,4.54 25.17,4.37 v25.5,4.37 | J1.41 23.12,11.59 v21.72,10.19
E56
  Bottom 0.09: J1.30 23.12,8.49 22.72,8.09 22.72,6.19 U1.F17
E57  (via drill 0.2)
  GND 0.09: v24.86,4.2 24.46,4.2 23.13,5.54 23.13,6.89 21.32,8.7 v21.32,9.69
  Bottom 0.09: v24.86,4.2 24.57,4.49 U1.G16 | J1.40 22.72,11.69 21.32,10.29 v21.32,9.69
E58
  Bottom 0.09: J1.31 22.72,8.49 22.47,8.24 22.47,5.94 U1.G17
E59  (via drill 0.2)
  GND 0.09: v25.34,3.7 25.37,3.69 24.47,3.69 22.7,5.46 22.7,6.99 20.92,8.77 v20.92,10.19
  Bottom 0.09: U1.H16 24.72,3.69 25.37,3.69 v25.34,3.7 | J1.39 22.32,11.59 v20.92,10.19
E60
  Bottom 0.09: J1.32 22.32,8.49 22.22,8.39 22.22,5.72 U1.H17
E61  (via drill 0.2)
  GND 0.09: v24.87,3.35 24.31,3.35 22.3,5.37 22.3,6.69 20.52,8.47 v20.52,9.69
  Bottom 0.09: v24.87,3.35 24.73,3.49 U1.J16 | J1.38 21.92,11.69 20.52,10.29 v20.52,9.69
E62
  Bottom 0.09: J1.33 21.92,5.49 U1.J17
E63  (via drill 0.2)
  GND 0.09: v25.17,2.83 24.33,2.83 21.94,5.22 21.94,6.49 20.12,8.31 v20.12,10.19
  Bottom 0.09: v25.17,2.83 25.01,2.99 U1.K16 | J1.37 21.52,11.59 v20.12,10.19
GND  (via drill 0.2)  (19 unrouted)
  other vias: 1.62,5.44 2.82,3.94 4.42,2.84 6.3,2.23 9.56,2.22 11.42,2.84 12.94,4.05 14.15,5.55 2.57,14.72 4.12,15.92 7.91,16.98 9.92,16.74 11.72,15.94 14.03,10.61 5.94,16.72 0.42,8.59 15.42,8.69 15.42,10.29 13.22,14.84 9.12,7.84
N$3
  Top 0.305: R5.1 31.98,17.04 32.54,16.82 IR2.K
N$4
  Top 0.305: R6.1 20.53,5.05 21.27,4.31 IR1.K
N$5  (via drill 0.2)
  other vias: 13.62,12.54
N$6  (via drill 0.2)
  other vias: 12.92,12.54
N$7  (via drill 0.2)
  other vias: 12.32,12.54
N$8  (via drill 0.2)
  other vias: 11.92,10.79
N$9  (via drill 0.2)
  other vias: 11.52,12.54
N$10  (via drill 0.2)
  other vias: 11.12,10.79
N$11  (via drill 0.2)
  other vias: 10.72,12.54
N$12  (via drill 0.2)
  other vias: 10.32,10.79
N$13  (via drill 0.2)
  other vias: 9.92,12.54
N$14  (via drill 0.2)
  other vias: 9.52,10.79
N$15  (via drill 0.2)
  other vias: 9.12,12.54
N$16  (via drill 0.2)
  other vias: 8.72,10.79
N$17  (via drill 0.2)
  other vias: 8.32,12.54
N$18  (via drill 0.2)
  other vias: 7.92,10.79
N$19  (via drill 0.2)
  other vias: 7.52,12.54
N$20  (via drill 0.2)
  other vias: 7.12,10.79
N$21  (via drill 0.2)
  other vias: 6.72,12.54
N$22  (via drill 0.2)
  other vias: 6.32,10.79
N$23  (via drill 0.2)
  other vias: 5.92,12.54
N$24  (via drill 0.2)
  other vias: 5.52,10.79
N$25  (via drill 0.2)
  other vias: 5.12,12.54
N$26  (via drill 0.2)
  other vias: 4.72,10.79
N$27  (via drill 0.2)
  other vias: 4.32,12.54
N$28  (via drill 0.2)
  other vias: 3.92,10.79
N$29  (via drill 0.2)
  other vias: 3.52,12.54
N$30  (via drill 0.2)
  other vias: 3.12,10.79
N$31  (via drill 0.2)
  other vias: 2.82,12.54
N$32  (via drill 0.2)
  other vias: 2.32,12.54
N$33  (via drill 0.2)
  other vias: 13.12,10.19
N$34  (via drill 0.2)
  other vias: 13.72,10.19
N$35  (via drill 0.2)
  other vias: 14.32,10.19
N$36
  Bottom 0.2: U1.N17 23.91,1.51 23.37,1.51 22.63,2.25 C5.1
N$37  (via drill 0.2)
  other vias: 14.32,8.44
N$38  (via drill 0.2)
  other vias: 12.72,10.79
N$39  (via drill 0.2 pad 0.25)
  GND 0.09: v24.17,1.15 24.17,1.81 21.76,4.22 v21.76,4.78
  Bottom 0.09: U1.N16 24.42,1.4 v24.17,1.15 | v21.76,4.78 21.54,4.78 TP2.TP
N$40  (via drill 0.2)
  other vias: 13.52,10.79
N$41  (via drill 0.2)
  other vias: 2.32,10.79
N$42  (via drill 0.2)
  other vias: 1.52,10.79
N$199  (via drill 0.2)
  other vias: 1.62,10.29
N$200  (via drill 0.2)
  other vias: 2.12,10.19
N$201  (via drill 0.2)
  other vias: 2.72,10.19
N$202  (via drill 0.2)
  other vias: 3.12,8.44
N$203  (via drill 0.2)
  other vias: 3.52,10.19
N$204  (via drill 0.2)
  other vias: 3.92,8.44
N$205  (via drill 0.2)
  other vias: 4.32,10.19
N$206  (via drill 0.2)
  other vias: 4.72,8.44
N$207  (via drill 0.2)
  other vias: 5.12,10.19
N$208  (via drill 0.2)
  other vias: 5.52,8.44
N$209  (via drill 0.2)
  other vias: 5.92,10.19
N$210  (via drill 0.2)
  other vias: 6.32,8.44
N$211  (via drill 0.2)
  other vias: 6.72,10.19
N$212  (via drill 0.2)
  other vias: 7.12,8.44
N$213  (via drill 0.2)
  other vias: 7.52,10.19
N$214  (via drill 0.2)
  other vias: 7.92,8.44
N$215  (via drill 0.2)
  other vias: 8.32,10.19
N$216  (via drill 0.2)
  other vias: 8.72,8.44
N$217  (via drill 0.2)
  other vias: 9.12,10.19
N$218  (via drill 0.2)
  other vias: 9.52,8.44
N$219  (via drill 0.2)
  other vias: 9.92,10.19
N$220  (via drill 0.2)
  other vias: 10.32,8.44
N$221  (via drill 0.2)
  other vias: 10.72,10.19
N$222  (via drill 0.2)
  other vias: 11.12,8.44
N$223  (via drill 0.2)
  other vias: 11.52,10.19
N$224  (via drill 0.2)
  other vias: 11.92,8.44
N$225  (via drill 0.2)
  other vias: 12.32,10.19
N$226  (via drill 0.2)
  other vias: 12.72,8.44
REF  (via drill 0.2 pad 0.25)
  Top 0.152: v32.8,14.06 32.8,12.76 32.4,12.37 24.97,12.37 24.7,12.64 R1.2 24.7,15.37 24.67,15.4 REF.1
  Bottom 0.15: U1.M1 32.47,2.54 32.47,2.86 32.66,3.05
  Bottom 0.2: 32.66,3.05 34.62,5.01 34.62,7.21 35.85,8.44 35.85,10.67 35.31,11.21 34.73,11.21 34.3,11.64 34.3,11.94 J1.69 34.32,12.54 v32.8,14.06
RHD_CLK_N  (via drill 0.2)
  Top 0.09: J2.9 28.87,9.62 29.19,9.3 29.19,7.34 28.56,6.7 28.26,6.7 27.71,6.16 27.71,5.73 28.01,5.43 28.01,3.26 27.92,3.17 27.92,2.41 28.35,1.98 R3.1 28.24,1.94 v28.24,0.79
  Bottom 0.09: v28.24,0.79 28.24,1.15 U1.N9
RHD_CLK_P  (via drill 0.2)
  Top 0.09: J2.10 28.87,7.27 28.48,6.88 28.18,6.88 27.53,6.23 27.53,5.66 27.83,5.36 27.83,3.33 27.29,2.79 R3.2 27.25,1.94 v27.25,0.9
  Bottom 0.09: v27.25,0.9 27.25,1.32 U1.N10
RHD_CS_N  (via drill 0.2)
  Top 0.09: v29.75,0.75 29.75,1.24 R2.1 30.1,2.89 29.32,2.89 28.99,3.22 28.99,3.3 | J2.11 29.51,9.65 29.99,9.17 29.99,8.75 30.14,8.59 30.14,7.4 29.67,6.93 29.41,6.93 28.99,6.52 28.99,3.3 | 28.99,3.3
  Bottom 0.09: v29.75,0.75 29.25,0.75 29.22,0.79 29.21,0.79 28.93,1.06 28.93,1.48 U1.N7
RHD_CS_P  (via drill 0.2)
  Top 0.09: J2.12 29.51,8.49 29.62,8.61 29.62,8.69 29.96,8.35 29.96,7.49 29.58,7.11 29.33,7.11 28.81,6.59 28.81,3.12 R2.2 28.97,1.52 28.97,0.63 v28.72,0.39
  Bottom 0.09: U1.N8 28.72,1.19 v28.72,0.39
RHD_MISO_N  (via drill 0.2)
  Top 0.09: v25.65,0.62 25.57,0.74 25.49,0.66 24.95,0.66 24.62,1 24.62,1.2 24.19,1.63 24.19,6.09 25.26,7.16 27.12,7.16 27.28,7.33 27.28,9.35 27.62,9.69 27.62,10.62 J2.5
  Bottom 0.09: v25.65,0.62 25.92,0.89 U1.N13
RHD_MISO_P  (via drill 0.2)
  Top 0.09: J2.6 27.6,7.42 27.6,7.37 27.21,6.98 25.34,6.98 24.37,6.02 24.37,1.71 24.59,1.5 24.59,1.49 24.67,1.41 v25.08,1.03
  Bottom 0.09: v25.08,1.03 25.42,1.44 U1.N14
RHD_MOSI_N  (via drill 0.2)
  Top 0.09: J2.7 28.21,10.61 28.22,10.6 28.22,9.69 27.92,9.39 27.92,7.22 27.13,6.43 27.13,5.43 26.48,4.78 26.21,4.78 25.93,4.5 25.93,3.13 25.54,2.74 25.54,2.44 25.11,2.01 25.01,1.86 25.07,1.92 R4.1 25.58,1.44 25.58,1.25 25.84,0.99 25.84,0.98 26.29,0.53 v26.38,0.53
  Bottom 0.09: v26.38,0.53 26.92,1.07 U1.N11
RHD_MOSI_P  (via drill 0.2)
  Top 0.09: J2.8 28.11,8.13 28.11,7.16 27.31,6.36 27.31,5.36 26.56,4.6 26.33,4.6 26.11,4.38 26.11,3.06 25.88,2.83 25.88,2.11 R4.2 26.32,1.77 v26.32,1.09
  Bottom 0.09: U1.N12 26.42,1.19 v26.32,1.09
VCOAX
  Bottom 0.09: J1.M3 J1.36
XOUT  (via drill 0.2)
  Top 0.09: C2.1 34.52,4.99 34.44,4.91 33.82,4.29 33.82,3.26 33.48,2.92 33.48,2.79 33.28,2.6 33.15,2.6 31.62,1.06 v31.35,1.06
  Top 0.2: U2.12 34.08,5.27 34.44,4.91
  Bottom 0.09: U1.N3 v31.35,1.06
YOUT  (via drill 0.2)
  Top 0.09: v30.9,0.82 30.9,1.08 31.21,1.4 31.41,1.4 31.66,1.64 31.66,2.3 32.49,3.13 32.49,4.2 C3.1
  Top 0.2: U2.10 32.78,5.23 C3.1
  Bottom 0.09: v30.9,0.82 30.42,1.3 U1.N4
ZOUT  (via drill 0.2)
  Top 0.09: v30.4,0.65 30.4,0.84 31.14,1.58 31.28,1.58 31.41,1.7 31.41,2.41 31.49,2.51 32.26,3.28 32.26,4.33 C4.1
  Top 0.2: U2.8 31.23,5.36 C4.1
  Bottom 0.09: v30.4,0.65 29.92,1.12 U1.N5

### Text on the board
tPlace: U2 | HS-64-SPI / ver. 1.1 / FC & JPN
bPlace: For / Research / Use Only | GND | AUXO
Measures: EIB | Low / Profile / Headstage
_tNames: GND | REF | R5 | IR2 | VDD | C1 | R1 | J2 | C7 | R6 | C2 | IR1 | C4 | C3 | R4 | R3 | R2
_bNames: J1 | U1 | C6